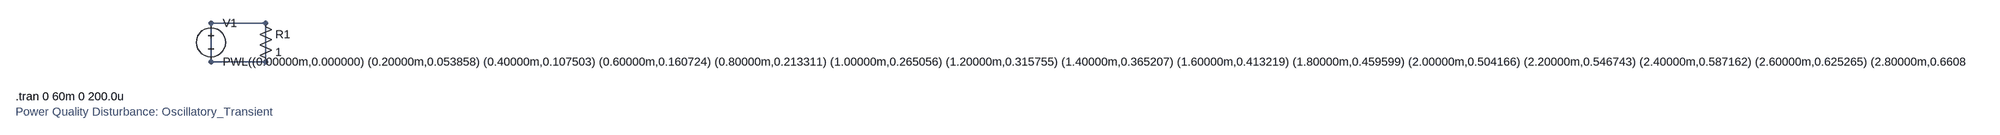
[diagram p0: schematic Oscillatory_Transient.asc]
Oscillatory_Transient.asc, the LTspice schematic file:
Version 4
SHEET 1 880 680
WIRE 192 128 80 128
WIRE 80 128 80 208
WIRE 192 208 80 208
WIRE 192 128 192 208
SYMBOL voltage 80 112 R0
WINDOW 123 0 0 Left 0
WINDOW 39 0 0 Left 0
SYMATTR InstName V1
SYMATTR Value PWL((0.00000m,0.000000) (0.20000m,0.053858) (0.40000m,0.107503) (0.60000m,0.160724) (0.80000m,0.213311) (1.00000m,0.265056) (1.20000m,0.315755) (1.40000m,0.365207) (1.60000m,0.413219) (1.80000m,0.459599) (2.00000m,0.504166) (2.20000m,0.546743) (2.40000m,0.587162) (2.60000m,0.625265) (2.80000m,0.660899) (3.00000m,0.693925) (3.20000m,0.724213) (3.40000m,0.751642) (3.60000m,0.776105) (3.80000m,0.797505) (4.00000m,0.815758) (4.20000m,0.830791) (4.40000m,0.842546) (4.60000m,0.850975) (4.80000m,0.856046) (5.00000m,0.857739) (5.20000m,0.856046) (5.40000m,0.850975) (5.60000m,0.842546) (5.80000m,0.830791) (6.00000m,0.815758) (6.20000m,0.797505) (6.40000m,0.776105) (6.60000m,0.751642) (6.80000m,0.724213) (7.00000m,0.693925) (7.20000m,0.660899) (7.40000m,0.625265) (7.60000m,0.587162) (7.80000m,0.546743) (8.00000m,0.504166) (8.20000m,0.459599) (8.40000m,0.413219) (8.60000m,0.365207) (8.80000m,0.315755) (9.00000m,0.265056) (9.20000m,0.213311) (9.40000m,0.160724) (9.60000m,0.107503) (9.80000m,0.053858) (10.00000m,0.000000) (10.20000m,-0.053858) (10.40000m,-0.107503) (10.60000m,-0.160724) (10.80000m,-0.213311) (11.00000m,-0.265056) (11.20000m,-0.315755) (11.40000m,-0.365207) (11.60000m,-0.413219) (11.80000m,-0.459599) (12.00000m,-0.504166) (12.20000m,-0.546743) (12.40000m,-0.587162) (12.60000m,-0.625265) (12.80000m,-0.660899) (13.00000m,-0.693925) (13.20000m,-0.724213) (13.40000m,-0.751642) (13.60000m,-0.776105) (13.80000m,-0.797505) (14.00000m,-0.815758) (14.20000m,-0.830791) (14.40000m,-0.842546) (14.60000m,-0.850975) (14.80000m,-0.856046) (15.00000m,-0.857739) (15.20000m,-0.856046) (15.40000m,-0.850975) (15.60000m,-0.842546) (15.80000m,-0.830791) (16.00000m,-0.815758) (16.20000m,-0.797505) (16.40000m,-0.776105) (16.60000m,-0.751642) (16.80000m,-0.724213) (17.00000m,-0.693925) (17.20000m,-0.660899) (17.40000m,-0.625265) (17.60000m,-0.587162) (17.80000m,-0.546743) (18.00000m,-0.504166) (18.20000m,-0.459599) (18.40000m,-0.413219) (18.60000m,-0.365207) (18.80000m,-0.315755) (19.00000m,-0.265056) (19.20000m,-0.213311) (19.40000m,-0.160724) (19.60000m,-0.107503) (19.80000m,-0.053858) (20.00000m,-0.000000) (20.20000m,0.230005) (20.40000m,0.414997) (20.60000m,0.533595) (20.80000m,0.578086) (21.00000m,0.554863) (21.20000m,0.482227) (21.40000m,0.386138) (21.60000m,0.294848) (21.80000m,0.233488) (22.00000m,0.219599) (22.20000m,0.260387) (22.40000m,0.352080) (22.60000m,0.481352) (22.80000m,0.628427) (23.00000m,0.771155) (23.20000m,0.889247) (23.40000m,0.967872) (23.60000m,1.000000) (23.80000m,0.987142) (24.00000m,0.938460) (24.20000m,0.868524) (24.40000m,0.794237) (24.60000m,0.731533) (24.80000m,0.692492) (25.00000m,0.683373) (25.20000m,0.703854) (25.40000m,0.747552) (25.60000m,0.803622) (25.80000m,0.859082) (26.00000m,0.901364) (26.20000m,0.920619) (26.40000m,0.911362) (26.60000m,0.873194) (26.80000m,0.810541) (27.00000m,0.731517) (27.20000m,0.646191) (27.40000m,0.564609) (27.60000m,0.494965) (27.80000m,0.442238) (28.00000m,0.407528) (28.20000m,0.388147) (28.40000m,0.378412) (28.60000m,0.370934) (28.80000m,0.358141) (29.00000m,0.333719) (29.20000m,0.293732) (29.40000m,0.237220) (29.60000m,0.166204) (29.80000m,0.085148) (30.00000m,0.000000) (30.20000m,-0.082975) (30.40000m,-0.158331) (30.60000m,-0.222359) (30.80000m,-0.273608) (31.00000m,-0.312961) (31.20000m,-0.343272) (31.40000m,-0.368667) (31.60000m,-0.393652) (31.80000m,-0.422223) (32.00000m,-0.457127) (32.20000m,-0.499409) (32.40000m,-0.548304) (32.60000m,-0.601476) (32.80000m,-0.655531) (33.00000m,-0.706691) (33.20000m,-0.751493) (33.40000m,-0.787385) (33.60000m,-0.813115) (33.80000m,-0.828852) (34.00000m,-0.836040) (34.20000m,-0.837028) (34.40000m,-0.834560) (34.60000m,-0.831231) (34.80000m,-0.829011) (35.00000m,-0.828916) (35.20000m,-0.830889) (35.40000m,-0.833879) (35.60000m,-0.836112) (35.80000m,-0.835468) (36.00000m,-0.829908) (36.20000m,-0.817856) (36.40000m,-0.798463) (36.60000m,-0.771734) (36.80000m,-0.738483) (37.00000m,-0.700139) (37.20000m,-0.658468) (37.40000m,-0.615238) (37.60000m,-0.571922) (37.80000m,-0.529469) (38.00000m,-0.488192) (38.20000m,-0.447788) (38.40000m,-0.407465) (38.60000m,-0.366154) (38.80000m,-0.322761) (39.00000m,-0.276406) (39.20000m,-0.226604) (39.40000m,-0.173369) (39.60000m,-0.117206) (39.80000m,-0.059030) (40.00000m,-0.000000) (40.20000m,0.058671) (40.40000m,0.115905) (40.60000m,0.170912) (40.80000m,0.223278) (41.00000m,0.272974) (41.20000m,0.320303) (41.40000m,0.365779) (41.60000m,0.409984) (41.80000m,0.453421) (42.00000m,0.496391) (42.20000m,0.538919) (42.40000m,0.580739) (42.60000m,0.621332) (42.80000m,0.660012) (43.00000m,0.696035) (43.20000m,0.728722) (43.40000m,0.757550) (43.60000m,0.782223) (43.80000m,0.802687) (44.00000m,0.819111) (44.20000m,0.831822) (44.40000m,0.841226) (44.60000m,0.847711) (44.80000m,0.851577) (45.00000m,0.852974) (45.20000m,0.851888) (45.40000m,0.848149) (45.60000m,0.841482) (45.80000m,0.831564) (46.00000m,0.818097) (46.20000m,0.800869) (46.40000m,0.779801) (46.60000m,0.754963) (46.80000m,0.726571) (47.00000m,0.694952) (47.20000m,0.660497) (47.40000m,0.623607) (47.60000m,0.584643) (47.80000m,0.543888) (48.00000m,0.501526) (48.20000m,0.457647) (48.40000m,0.412268) (48.60000m,0.365364) (48.80000m,0.316913) (49.00000m,0.266932) (49.20000m,0.215508) (49.40000m,0.162814) (49.60000m,0.109107) (49.80000m,0.054713) (50.00000m,0.000000) (50.20000m,-0.054653) (50.40000m,-0.108892) (50.60000m,-0.162408) (50.80000m,-0.214958) (51.00000m,-0.266365) (51.20000m,-0.316507) (51.40000m,-0.365302) (51.60000m,-0.412684) (51.80000m,-0.458578) (52.00000m,-0.502881) (52.20000m,-0.545450) (52.40000m,-0.586101) (52.60000m,-0.624615) (52.80000m,-0.660752) (53.00000m,-0.694274) (53.20000m,-0.724958) (53.40000m,-0.752619) (53.60000m,-0.777116) (53.80000m,-0.798362) (54.00000m,-0.816312) (54.20000m,-0.830962) (54.40000m,-0.842327) (54.60000m,-0.850436) (54.80000m,-0.855307) (55.00000m,-0.856951) (55.20000m,-0.855359) (55.40000m,-0.850508) (55.60000m,-0.842370) (55.80000m,-0.830919) (56.00000m,-0.816144) (56.20000m,-0.798061) (56.40000m,-0.776716) (56.60000m,-0.752191) (56.80000m,-0.724603) (57.00000m,-0.694095) (57.20000m,-0.660832) (57.40000m,-0.624991) (57.60000m,-0.586746) (57.80000m,-0.546271) (58.00000m,-0.503730) (58.20000m,-0.459277) (58.40000m,-0.413061) (58.60000m,-0.365233) (58.80000m,-0.315946) (59.00000m,-0.265366) (59.20000m,-0.213674) (59.40000m,-0.161070) (59.60000m,-0.107768) (59.80000m,-0.053999))
SYMBOL res 176 112 R0
SYMATTR InstName R1
SYMATTR Value 1
TEXT -320 280 Left 2 !.tran 0 60m 0 200.0u
TEXT -320 312 Left 2 ;Power Quality Disturbance: Oscillatory_Transient

The netlist it stands for:
* Oscillatory_Transient.asc
V1 N001 N001 PWL((0.00000m,0.000000) (0.20000m,0.053858) (0.40000m,0.107503) (0.60000m,0.160724) (0.80000m,0.213311) (1.00000m,0.265056) (1.20000m,0.315755) (1.40000m,0.365207) (1.60000m,0.413219) (1.80000m,0.459599) (2.00000m,0.504166) (2.20000m,0.546743) (2.40000m,0.587162) (2.60000m,0.625265) (2.80000m,0.660899) (3.00000m,0.693925) (3.20000m,0.724213) (3.40000m,0.751642) (3.60000m,0.776105) (3.80000m,0.797505) (4.00000m,0.815758) (4.20000m,0.830791) (4.40000m,0.842546) (4.60000m,0.850975) (4.80000m,0.856046) (5.00000m,0.857739) (5.20000m,0.856046) (5.40000m,0.850975) (5.60000m,0.842546) (5.80000m,0.830791) (6.00000m,0.815758) (6.20000m,0.797505) (6.40000m,0.776105) (6.60000m,0.751642) (6.80000m,0.724213) (7.00000m,0.693925) (7.20000m,0.660899) (7.40000m,0.625265) (7.60000m,0.587162) (7.80000m,0.546743) (8.00000m,0.504166) (8.20000m,0.459599) (8.40000m,0.413219) (8.60000m,0.365207) (8.80000m,0.315755) (9.00000m,0.265056) (9.20000m,0.213311) (9.40000m,0.160724) (9.60000m,0.107503) (9.80000m,0.053858) (10.00000m,0.000000) (10.20000m,-0.053858) (10.40000m,-0.107503) (10.60000m,-0.160724) (10.80000m,-0.213311) (11.00000m,-0.265056) (11.20000m,-0.315755) (11.40000m,-0.365207) (11.60000m,-0.413219) (11.80000m,-0.459599) (12.00000m,-0.504166) (12.20000m,-0.546743) (12.40000m,-0.587162) (12.60000m,-0.625265) (12.80000m,-0.660899) (13.00000m,-0.693925) (13.20000m,-0.724213) (13.40000m,-0.751642) (13.60000m,-0.776105) (13.80000m,-0.797505) (14.00000m,-0.815758) (14.20000m,-0.830791) (14.40000m,-0.842546) (14.60000m,-0.850975) (14.80000m,-0.856046) (15.00000m,-0.857739) (15.20000m,-0.856046) (15.40000m,-0.850975) (15.60000m,-0.842546) (15.80000m,-0.830791) (16.00000m,-0.815758) (16.20000m,-0.797505) (16.40000m,-0.776105) (16.60000m,-0.751642) (16.80000m,-0.724213) (17.00000m,-0.693925) (17.20000m,-0.660899) (17.40000m,-0.625265) (17.60000m,-0.587162) (17.80000m,-0.546743) (18.00000m,-0.504166) (18.20000m,-0.459599) (18.40000m,-0.413219) (18.60000m,-0.365207) (18.80000m,-0.315755) (19.00000m,-0.265056) (19.20000m,-0.213311) (19.40000m,-0.160724) (19.60000m,-0.107503) (19.80000m,-0.053858) (20.00000m,-0.000000) (20.20000m,0.230005) (20.40000m,0.414997) (20.60000m,0.533595) (20.80000m,0.578086) (21.00000m,0.554863) (21.20000m,0.482227) (21.40000m,0.386138) (21.60000m,0.294848) (21.80000m,0.233488) (22.00000m,0.219599) (22.20000m,0.260387) (22.40000m,0.352080) (22.60000m,0.481352) (22.80000m,0.628427) (23.00000m,0.771155) (23.20000m,0.889247) (23.40000m,0.967872) (23.60000m,1.000000) (23.80000m,0.987142) (24.00000m,0.938460) (24.20000m,0.868524) (24.40000m,0.794237) (24.60000m,0.731533) (24.80000m,0.692492) (25.00000m,0.683373) (25.20000m,0.703854) (25.40000m,0.747552) (25.60000m,0.803622) (25.80000m,0.859082) (26.00000m,0.901364) (26.20000m,0.920619) (26.40000m,0.911362) (26.60000m,0.873194) (26.80000m,0.810541) (27.00000m,0.731517) (27.20000m,0.646191) (27.40000m,0.564609) (27.60000m,0.494965) (27.80000m,0.442238) (28.00000m,0.407528) (28.20000m,0.388147) (28.40000m,0.378412) (28.60000m,0.370934) (28.80000m,0.358141) (29.00000m,0.333719) (29.20000m,0.293732) (29.40000m,0.237220) (29.60000m,0.166204) (29.80000m,0.085148) (30.00000m,0.000000) (30.20000m,-0.082975) (30.40000m,-0.158331) (30.60000m,-0.222359) (30.80000m,-0.273608) (31.00000m,-0.312961) (31.20000m,-0.343272) (31.40000m,-0.368667) (31.60000m,-0.393652) (31.80000m,-0.422223) (32.00000m,-0.457127) (32.20000m,-0.499409) (32.40000m,-0.548304) (32.60000m,-0.601476) (32.80000m,-0.655531) (33.00000m,-0.706691) (33.20000m,-0.751493) (33.40000m,-0.787385) (33.60000m,-0.813115) (33.80000m,-0.828852) (34.00000m,-0.836040) (34.20000m,-0.837028) (34.40000m,-0.834560) (34.60000m,-0.831231) (34.80000m,-0.829011) (35.00000m,-0.828916) (35.20000m,-0.830889) (35.40000m,-0.833879) (35.60000m,-0.836112) (35.80000m,-0.835468) (36.00000m,-0.829908) (36.20000m,-0.817856) (36.40000m,-0.798463) (36.60000m,-0.771734) (36.80000m,-0.738483) (37.00000m,-0.700139) (37.20000m,-0.658468) (37.40000m,-0.615238) (37.60000m,-0.571922) (37.80000m,-0.529469) (38.00000m,-0.488192) (38.20000m,-0.447788) (38.40000m,-0.407465) (38.60000m,-0.366154) (38.80000m,-0.322761) (39.00000m,-0.276406) (39.20000m,-0.226604) (39.40000m,-0.173369) (39.60000m,-0.117206) (39.80000m,-0.059030) (40.00000m,-0.000000) (40.20000m,0.058671) (40.40000m,0.115905) (40.60000m,0.170912) (40.80000m,0.223278) (41.00000m,0.272974) (41.20000m,0.320303) (41.40000m,0.365779) (41.60000m,0.409984) (41.80000m,0.453421) (42.00000m,0.496391) (42.20000m,0.538919) (42.40000m,0.580739) (42.60000m,0.621332) (42.80000m,0.660012) (43.00000m,0.696035) (43.20000m,0.728722) (43.40000m,0.757550) (43.60000m,0.782223) (43.80000m,0.802687) (44.00000m,0.819111) (44.20000m,0.831822) (44.40000m,0.841226) (44.60000m,0.847711) (44.80000m,0.851577) (45.00000m,0.852974) (45.20000m,0.851888) (45.40000m,0.848149) (45.60000m,0.841482) (45.80000m,0.831564) (46.00000m,0.818097) (46.20000m,0.800869) (46.40000m,0.779801) (46.60000m,0.754963) (46.80000m,0.726571) (47.00000m,0.694952) (47.20000m,0.660497) (47.40000m,0.623607) (47.60000m,0.584643) (47.80000m,0.543888) (48.00000m,0.501526) (48.20000m,0.457647) (48.40000m,0.412268) (48.60000m,0.365364) (48.80000m,0.316913) (49.00000m,0.266932) (49.20000m,0.215508) (49.40000m,0.162814) (49.60000m,0.109107) (49.80000m,0.054713) (50.00000m,0.000000) (50.20000m,-0.054653) (50.40000m,-0.108892) (50.60000m,-0.162408) (50.80000m,-0.214958) (51.00000m,-0.266365) (51.20000m,-0.316507) (51.40000m,-0.365302) (51.60000m,-0.412684) (51.80000m,-0.458578) (52.00000m,-0.502881) (52.20000m,-0.545450) (52.40000m,-0.586101) (52.60000m,-0.624615) (52.80000m,-0.660752) (53.00000m,-0.694274) (53.20000m,-0.724958) (53.40000m,-0.752619) (53.60000m,-0.777116) (53.80000m,-0.798362) (54.00000m,-0.816312) (54.20000m,-0.830962) (54.40000m,-0.842327) (54.60000m,-0.850436) (54.80000m,-0.855307) (55.00000m,-0.856951) (55.20000m,-0.855359) (55.40000m,-0.850508) (55.60000m,-0.842370) (55.80000m,-0.830919) (56.00000m,-0.816144) (56.20000m,-0.798061) (56.40000m,-0.776716) (56.60000m,-0.752191) (56.80000m,-0.724603) (57.00000m,-0.694095) (57.20000m,-0.660832) (57.40000m,-0.624991) (57.60000m,-0.586746) (57.80000m,-0.546271) (58.00000m,-0.503730) (58.20000m,-0.459277) (58.40000m,-0.413061) (58.60000m,-0.365233) (58.80000m,-0.315946) (59.00000m,-0.265366) (59.20000m,-0.213674) (59.40000m,-0.161070) (59.60000m,-0.107768) (59.80000m,-0.053999))
R1 N001 N001 1
.tran 0 60m 0 200.0u
* Power Quality Disturbance: Oscillatory_Transient
.backanno
.end